# EAGLE design tracker (EAGLE 8.2.2)
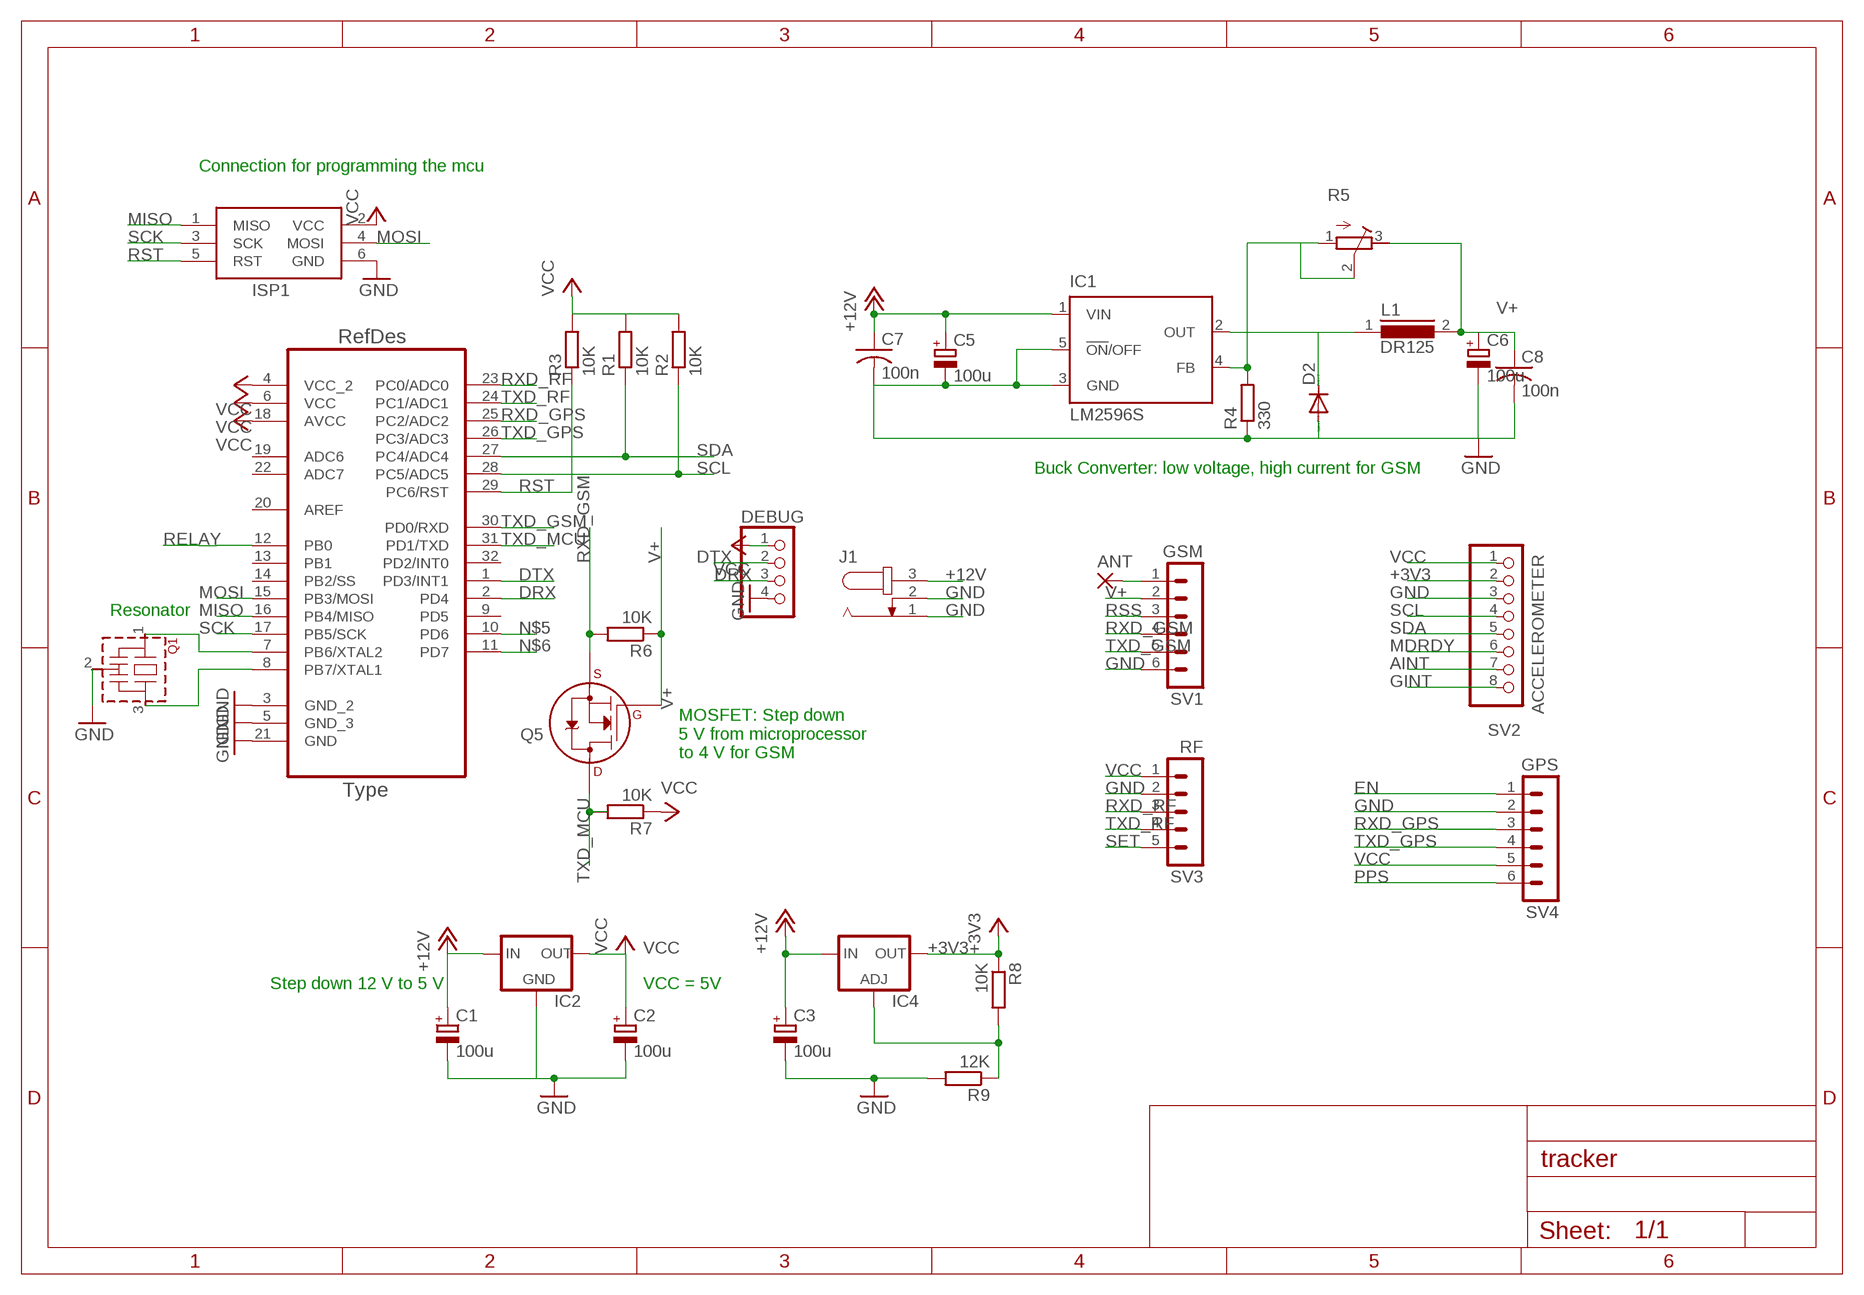
[diagram p0: schematic, sheet 1]

## Parts
ANT  WIREPAD2,15/1,0  [2,15/1,0]
C1  100u  CPOL-EUE2.5-5  [E2,5-5]
C2  100u  CPOL-EUE2.5-5  [E2,5-5]
C3  100u  CPOL-EUE2.5-5  [E2,5-5]
C5  100u  CPOL-EUE2.5-5  [E2,5-5]
C6  100u  CPOL-EUE2.5-5  [E2,5-5]
C7  100n  C-US025-024X044  [C025-024X044]
C8  100n  C-US025-024X044  [C025-024X044]
D2  DIODE-DO-214AC  [DO-214AC]
DEBUG  PINHD-1X4  [1X04]
IC1  LM2596S  [TO263-5]
IC2  78XXS  [78XXS]
IC4  LM317TS  [317TS]
ISP1  AVRISP-6  [AVRISP]
J1  JACK-PLUG0  [SPC4077]
L1  DR125  [DR125]
Q1  CSTLS_X  [CSTLS_X]
Q5  2N7000_TO92  [TO-92]
R1  10K  R-EU_R1210  [R1210]
R2  10K  R-EU_R1210  [R1210]
R3  10K  R-EU_R1210  [R1210]
R4  330  R-EU_R1210  [R1210]
R5  R-TRIMM64X  [RTRIM64X]
R6  10K  R-EU_R1210  [R1210]
R7  10K  R-EU_R1210  [R1210]
R8  10K  R-EU_0207/10  [0207/10]
R9  12K  R-EU_0207/10  [0207/10]
SV1  GSM  MA06-1  [MA06-1]
SV2  ACCELEROMETER  PINHD-1X8  [1X08]
SV3  RF  MA05-1  [MA05-1]
SV4  GPS  MA06-1  [MA06-1]
U1  ATMEGA328P-AU  [QFP80P900X900X120-32N]

## Nets
+3V3: IC4.2(OUT) R8.1 SV2.2
+12V: C1.+ C3.+ C5.+ C7.1 IC1.1(VIN) IC2.IN IC4.3(IN) J1.3
AINT: SV2.7
DRX: DEBUG.3 U1.2(PD4)
DTX: DEBUG.2 U1.1(PD3/INT1)
EN: SV4.1
GINT: SV2.8
GND: C1.- C2.- C3.- C5.- C6.- C7.2 C8.2 D2.A DEBUG.4 IC1.3(GND) IC1.5(!ON!/OFF) IC2.GND ISP1.6(GND) J1.1 J1.2 Q1.2(VSS) R4.1 R9.2 SV1.6 SV2.3 SV3.2 SV4.2 U1.3(GND_2) U1.5(GND_3) U1.21(GND)
MDRDY: SV2.6
MISO: ISP1.1(MISO) U1.16(PB4/MISO)
MOSI: ISP1.4(MOSI) U1.15(PB3/MOSI)
N$3: IC4.1(ADJ) R8.2 R9.1
N$4: ANT.1(P) SV1.1
N$5: U1.10(PD6)
N$6: U1.11(PD7)
N$8: Q1.1 U1.7(PB6/XTAL2)
N$9: Q1.3 U1.8(PB7/XTAL1)
N$11: D2.C IC1.2(OUT) L1.1
N$16: IC1.4(FB) R4.2 R5.1(A) R5.2(S)
PPS: SV4.6
RELAY: U1.12(PB0)
RSS: SV1.3
RST: ISP1.5(RST) R3.1 U1.29(PC6/RST)
RXD_GPS: SV4.3 U1.25(PC2/ADC2)
RXD_GSM: Q5.1(S) R6.2 SV1.4
RXD_RF: SV3.3 U1.23(PC0/ADC0)
SCK: ISP1.3(SCK) U1.17(PB5/SCK)
SCL: R2.1 SV2.4 U1.28(PC5/ADC5)
SDA: R1.1 SV2.5 U1.27(PC4/ADC4)
SET: SV3.5
TXD_GPS: SV4.4 U1.26(PC3/ADC3)
TXD_GSM: SV1.5 U1.30(PD0/RXD)
TXD_MCU: Q5.3(D) R7.2 U1.31(PD1/TXD)
TXD_RF: SV3.4 U1.24(PC1/ADC1)
V+: C6.+ C8.1 L1.2 Q5.2(G) R5.3(E) R6.1 SV1.2
VCC: C2.+ DEBUG.1 IC2.OUT ISP1.2(VCC) R1.2 R2.2 R3.2 R7.1 SV2.1 SV3.1 SV4.5 U1.4(VCC_2) U1.6(VCC) U1.18(AVCC)
Unconnected: U1.9(PD5) U1.13(PB1) U1.14(PB2/SS) U1.19(ADC6) U1.20(AREF) U1.22(ADC7) U1.32(PD2/INT0)

## Notes on the sheet
- Connection for programming the mcu
- Buck Converter: low voltage, high current for GSM
- Resonator
- MOSFET: Step down 
  5 V from microprocessor 
  to 4 V for GSM
- Step down 12 V to 5 V | VCC = 5V

## Library data of the parts
ANT = wirepad:WIREPAD: Wire PAD connect wire on PCB
C1-C3 C5 C6 = resistor:CPOL-EU: POLARIZED CAPACITOR, European symbol
C7 C8 = adafruit:C-US: CAPACITOR, American symbol
D2 = diode:DIODE-: DIODE
DEBUG = pinhead:PINHD-1X4: PIN HEADER
IC1 = national-semiconductor:LM2596: SIMPLE SWITCHER® Power Converter 150 kHz 3A Step-Down Voltage Regulator Source: http://www.national.com/ds/LM/LM2596.pdf; MF: NATIONAL SEMICONDUCTOR; MPN: LM2596S-ADJ/NOPB; OC_FARNELL: 9494367; OC_NEWARK: 41K3842
IC2 = v-reg:78XXS: VOLTAGE REGULATOR
IC4 = v-reg:LM317TS: VOLTAGE REGULATOR
ISP1 = adafruit:AVRISP: AVR ISP HEADER Standard 6 pin header for AVR programming
J1 = con-jack:JACK-PLUG: DC POWER JACK Power Jack, DC, Right Angle, Through Hole, Rated 5A at 16VDC, PC Terminals Distributor: Farnell (www.Farnell.de) Drawing: 84N1161.pdf / 84N1162.pdf Manufacturer: SPC Technology (www.spctechnology.com) Type: SPC4077 / SPC 4078; OC_FARNELL: unknown; OC_NEWARK: unknown
L1 = inductors:DR125: High Power Density, High Efficiency, Shielded Inductors Source: coiltronics_dr_series.pdf
Q1 = murata-resonators:CSTLS_X: Ceramic resonator 16.00 to 70.00 MHz
Q5 = transistors:2N700*: 2N7000, 2N7002, NDS7002A N-channel enhancement mode MOSFET
R1-R4 R6-R9 = resistor:R-EU_: RESISTOR, European symbol
R5 = resistor:R-TRIMM: Trimm resistor
SV1 SV4 = con-lstb:MA06-1: PIN HEADER; OC_FARNELL: unknown; OC_NEWARK: unknown
SV2 = pinhead:PINHD-1X8: PIN HEADER
SV3 = con-lstb:MA05-1: PIN HEADER; OC_FARNELL: unknown; OC_NEWARK: unknown
U1 = ATMEGA328P-AU:ATMEGA328P-AU; DESCRIPTION: 8-bit Microcontroller with In-System Programmable Flash; MPN: ATMEGA328P-AU; OC_FARNELL: 1715486; OC_NEWARK: 14R4631; PACKAGE: TQFP-32; SUPPLIER: Atmel

## Board
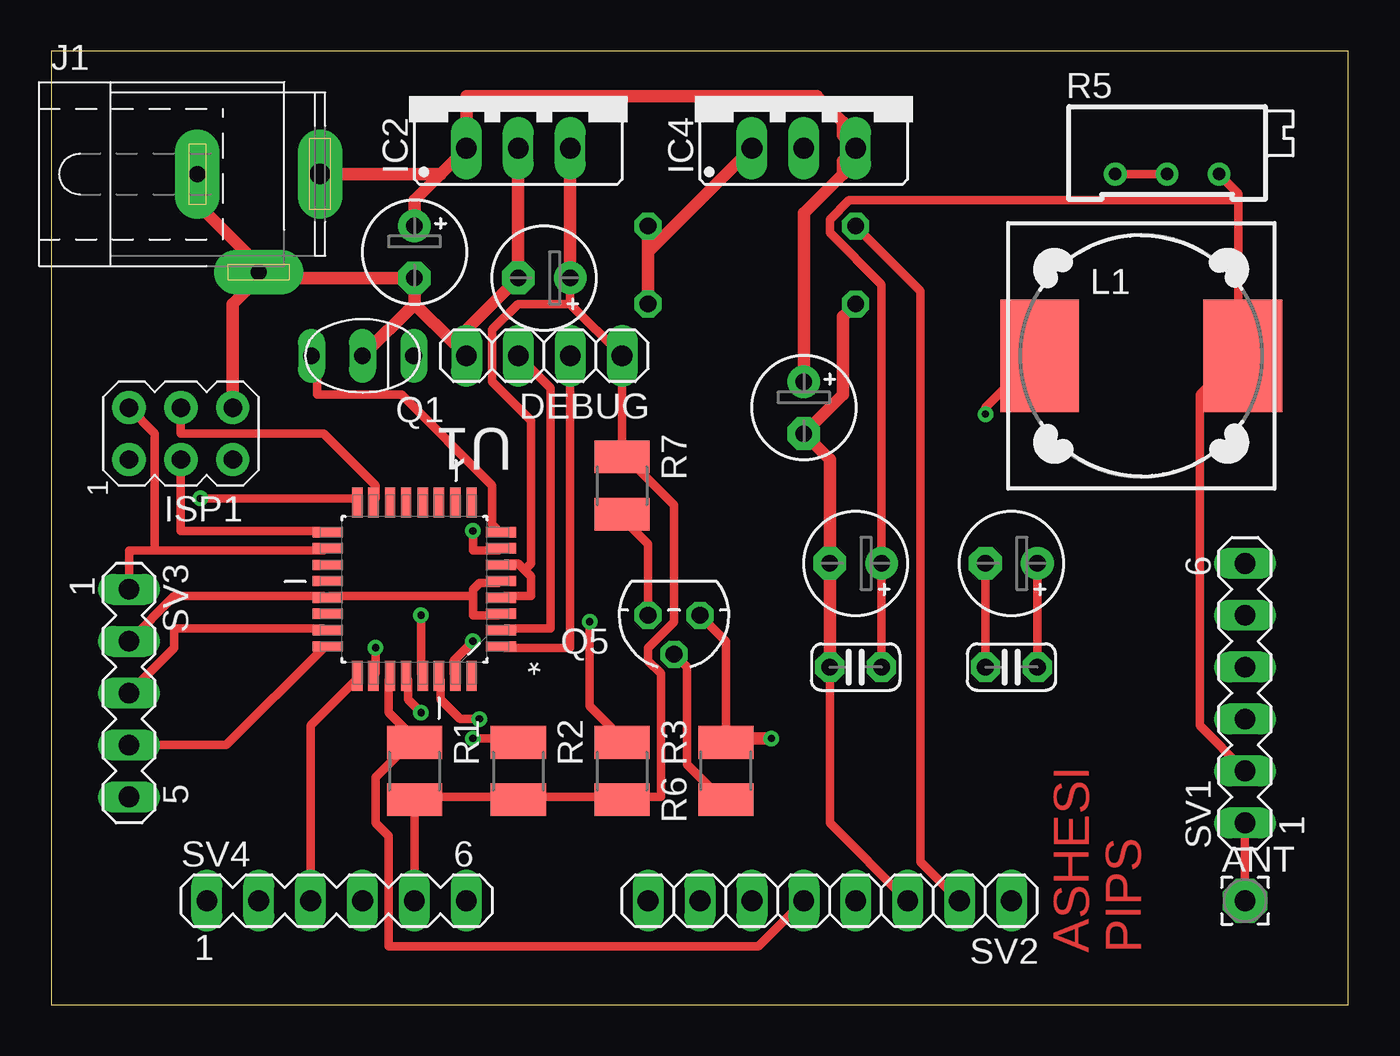
[diagram p1: board, top side]
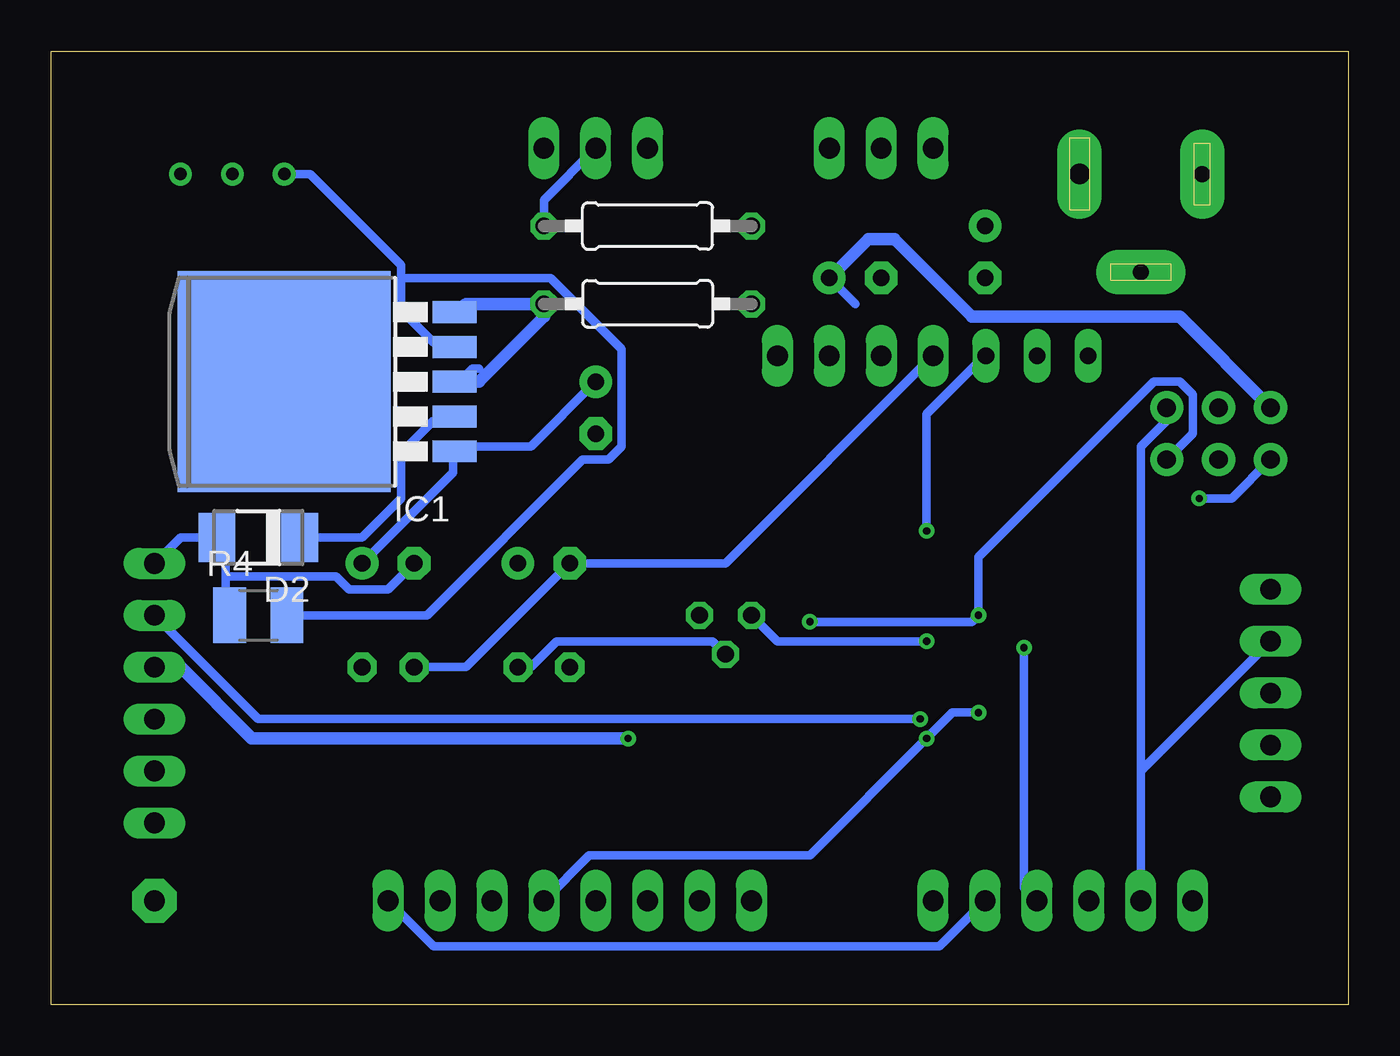
[diagram p2: board, bottom side, seen from below]

Size 63.48 x 46.66 mm. Coordinates in mm from the lower left corner, seen from the top.
Outline: 0,0 63.48,0 63.48,46.66 0,46.66 0,0
Copper layers (1*16): Top 0.035mm / dielectric 1.5mm / Bottom 0.035mm
Design rules "default *": minimum track width 24mil, minimum drill 0.35mm, track to track 10mil, track to pad 10mil, pad to pad 10mil, via to via 6mil, smd to smd 6mil, copper to edge 20mil, drill to drill 8mil, minimum pad ring 10mil, minimum via ring 8mil, stop-mask expansion 4mil, vias tented up to drill 0mil, thermal gap 10mil

### Footprints (pad centres in the part's own frame; a part is rotated, then mirrored left to right if it is on the bottom)
2,15/1,0 = drill 1.016 pad 2.159 octagon: 1 0,0
E2,5-5 = drill 0.813 pad 1.6: + -1.27,0 | drill 0.813 pad 1.6 octagon: - 1.27,0
C025-024X044 = drill 0.813 pad 1.422 octagon: 1 -1.27,0; 2 1.27,0
DO-214AC = smd 1.8 x 2.4: A 2.025,0; C -2.025,0
1X04 = drill 1.016 long: 1 -3.81,0; 2 -1.27,0; 3 1.27,0; 4 3.81,0
TO263-5 = smd 1.067 x 2.159: 1 -3.404,-5.791; 2 -1.702,-5.791; 3 0,-5.791; 4 1.702,-5.791; 5 3.404,-5.791 | smd 10.8 x 10.41: 6 0,2.54
78XXS = drill 1.016 long: GND 0,-2.54; IN -2.54,-2.54; OUT 2.54,-2.54
317TS = drill 1.016 long: 1 -2.54,-2.54; 2 0,-2.54; 3 2.54,-2.54
AVRISP = drill 0.9 pad 1.626: 1 -1.27,2.54; 2 1.27,2.54; 3 -1.27,0; 4 1.27,0; 5 -1.27,-2.54; 6 1.27,-2.54
SPC4077 = drill 0.8 pad 2.184 long: 1 -3,0; 2 0,-4.8 | drill 1 pad 2.184 long: 3 3,0
DR125 = smd 3.85 x 5.5: 1 -4.975,0; 2 4.975,0
CSTLS_X = drill 0.813 long: 1 -2.5,0; 2 0,0; 3 2.5,0
TO-92 = drill 0.813 octagon: 1 -1.27,0; 2 0,1.905; 3 1.27,0
R1210 = smd 1.6 x 2.7: 1 -1.4,0; 2 1.4,0
RTRIM64X = drill 0.61: 1 1.27,-2.54; 2 1.27,0; 3 1.27,2.54
0207/10 = drill 0.813 octagon: 1 -5.08,0; 2 5.08,0
MA06-1 = drill 1.016 long: 1 -6.35,0; 2 -3.81,0; 3 -1.27,0; 4 1.27,0; 5 3.81,0; 6 6.35,0
1X08 = drill 1.016 long: 1 -8.89,0; 2 -6.35,0; 3 -3.81,0; 4 -1.27,0; 5 1.27,0; 6 3.81,0; 7 6.35,0; 8 8.89,0
MA05-1 = drill 1.016 long: 1 -5.08,0; 2 -2.54,0; 3 0,0; 4 2.54,0; 5 5.08,0
QFP80P900X900X120-32N = smd 1.473 x 0.508: 1 -4.242,2.794; 2 -4.242,2.007; 3 -4.242,1.194; 4 -4.242,0.406; 5 -4.242,-0.406; 6 -4.242,-1.194; 7 -4.242,-2.007; 8 -4.242,-2.794; 17 4.242,-2.794; 18 4.242,-2.007; 19 4.242,-1.194; 20 4.242,-0.406; 21 4.242,0.406; 22 4.242,1.194; 23 4.242,2.007; 24 4.242,2.794 | smd 0.508 x 1.473: 9 -2.794,-4.242; 10 -2.007,-4.242; 11 -1.194,-4.242; 12 -0.406,-4.242; 13 0.406,-4.242; 14 1.194,-4.242; 15 2.007,-4.242; 16 2.794,-4.242; 25 2.794,4.242; 26 2.007,4.242; 27 1.194,4.242; 28 0.406,4.242; 29 -0.406,4.242; 30 -1.194,4.242; 31 -2.007,4.242; 32 -2.794,4.242

### Placement (x,y rotation side)
ANT  58.42,5.08 0 top
C1  36.83,29.21 270 top
C2  24.13,35.56 180 top
C3  17.78,36.83 270 top
C5  46.99,21.59 180 top
C6  39.37,21.59 180 top
C7  46.99,16.51 180 top
C8  39.37,16.51 180 top
D2  53.34,22.86 180 bottom
DEBUG  24.13,31.75 180 top
IC1  49.53,30.48 90 bottom
IC2  22.86,44.45 0 top
IC4  36.83,44.45 0 top
ISP1  6.35,27.94 90 top
J1  10.16,40.64 0 top
L1  53.34,31.75 0 top
Q1  15.24,31.75 180 top
Q5  30.48,19.05 180 top
R1  17.78,11.43 270 top
R2  22.86,11.43 270 top
R3  27.94,11.43 270 top
R4  53.34,19.05 0 bottom
R5  54.61,41.91 270 top
R6  33.02,11.43 90 top
R7  27.94,25.4 270 top
R8  34.29,38.1 0 bottom
R9  34.29,34.29 180 bottom
SV1  58.42,15.24 90 top
SV2  38.1,5.08 180 top
SV3  3.81,15.24 270 top
SV4  13.97,5.08 0 top
U1  17.78,20.32 180 top

### Tracks (layer width: path | path; a pad name or v marks a point on that pad's centre or on a via)
+3V3
  Top 0.406: SV2.2 42.55,6.99 42.55,34.93 R8.1
  Bottom 0.406: R8.1 39.37,39.37 IC4.2
+12V
  Top 0.406: C5.+ C7.1
  Top 0.61: C1.+ 36.83,38.73 38.73,40.64 38.73,41.28 IC4.3 38.73,42.55 38.73,43.18 37.47,44.45 20.32,44.45 IC2.IN 19.05,40.64 | 19.05,40.64 17.78,39.37 C3.+ | 19.05,40.64 J1.3
  Bottom 0.406: C5.+ 43.81,26.04 43.81,26.99 IC1.1 43.5,27.3 40,27.3 C1.+
DRX
  Top 0.406: DEBUG.3 24.45,30.16 24.45,18.41 22.22,18.41 U1.2
DTX
  Top 0.406: DEBUG.2 25.4,17.46 22.22,17.46 U1.1
GND
  Top 0.406: C5.- C7.2 | SV2.3 38.1,8.89 C8.2 | 20.64,20 20.64,20.32 20.96,20.64 21.91,20.64 U1.5 | 20.64,20 20.64,19.05 21.91,19.05 U1.3 | SV3.2 6.03,20 13.33,20 U1.21 13.65,20 20.64,20
  Top 0.61: J1.1 7.62,40.64 7.62,38.73 10.16,36.2 J1.2 10.16,35.56 | 10.16,35.56 8.89,34.29 ISP1.6 | IC2.GND C2.- 19.68,32.39 | 17.78,34.29 Q1.2 | 17.78,34.29 C3.- 10.16,35.56 | R9.2 38.73,33.66 38.73,29.85 C1.- 38.1,26.67 C6.- C8.2 | 19.68,32.39 17.78,34.29 | 19.68,32.39 DEBUG.4
  Bottom 0.406: SV1.6 57.15,22.86 D2.A 55.24,22.86 54.93,22.54 54.93,20.95 | 54.93,20.95 54.93,19.05 R4.1 | 42.55,31.11 42.86,31.11 43.5,30.48 IC1.3 | 43.5,33.66 IC1.5 | C7.2 43.18,16.51 C6.- 30.48,21.59 DEBUG.4 | 54.93,20.95 49.53,20.95 48.89,20.32 46.99,20.32 C5.- | 10.16,11.43 SV4.2 | SV3.2 10.16,11.43 | ISP1.6 8.89,28.57 10.16,27.3 10.16,11.43
  Bottom 0.61: IC1.3 42.55,30.48 39.37,33.66 R9.2 43.18,34.29 IC1.5
MISO  (via drill 0.35)
  Top 0.406: v7.3,24.76 14.92,24.76 U1.16
  Bottom 0.406: v7.3,24.76 5.71,24.76 ISP1.1
MOSI
  Top 0.406: ISP1.4 6.35,27.94 13.33,27.94 15.87,25.4 15.87,24.76 U1.15
N$3
  Top 0.61: R8.2 29.21,36.83 | 29.21,36.83 R9.1 | 29.21,36.83 IC4.1
N$4
  Top 0.406: ANT.1 SV1.1
N$8  (via drill 0.35)
  Top 0.406: v20.64,23.18 20.64,22.22 21.91,22.22 U1.7
  Bottom 0.406: v20.64,23.18 20.64,28.89 17.78,31.75 Q1.1
N$9
  Top 0.406: U1.8 21.91,23.18 21.59,23.49 21.59,25.4 17.14,29.85 13.02,29.85 13.02,31.75 Q1.3
N$11  (via drill 0.35)
  Top 0.406: v45.72,28.89 45.72,29.21 48.26,31.75 L1.1
  Bottom 0.406: 45.08,28.26 46.36,26.99 46.36,24.76 48.26,22.86 D2.C | 45.08,28.26 44.77,28.57 43.81,28.57 IC1.2 | 45.08,28.26 v45.72,28.89
N$16
  Top 0.406: R5.1 R5.2
  Bottom 0.406: 46.36,35.56 46.36,36.2 50.8,40.64 R5.1 | 46.36,35.56 46.36,33.97 44.77,32.39 43.81,32.39 IC1.4 | R4.2 45.08,19.05 37.47,26.67 36.19,26.67 35.56,27.3 35.56,32.07 39.05,35.56 46.36,35.56
RST  (via drill 0.35)
  Top 0.406: v18.1,19.05 18.1,16.19 U1.29 | v26.35,18.73 26.35,14.61 27.94,13.02 R3.1
  Bottom 0.406: ISP1.5 7.62,27.94 7.62,29.85 8.25,30.48 9.52,30.48 18.1,21.91 v18.1,19.05 18.41,18.73 v26.35,18.73
RXD_GPS
  Top 0.406: SV4.3 12.7,13.65 14.92,15.88 U1.25
RXD_GSM  (via drill 0.35)
  Top 0.406: Q5.1 33.02,17.78 33.02,13.02
  Top 0.61: v35.24,13.02 33.02,13.02 R6.2
  Bottom 0.61: SV1.4 57.15,16.51 53.66,13.02 v35.24,13.02
RXD_RF
  Top 0.406: SV3.3 6.03,17.46 6.03,18.41 13.33,18.41 U1.23
SCK
  Top 0.406: ISP1.3 6.35,23.18 13.33,23.18 U1.17
SCL  (via drill 0.35)
  Top 0.406: v18.1,14.29 17.46,14.92 17.46,15.88 U1.28 | v20.64,13.02 22.86,13.02 R2.1
  Bottom 0.406: v18.1,14.29 19.37,14.29 v20.64,13.02 26.35,7.3 37.15,7.3 SV2.4
SDA
  Top 0.406: 17.78,13.02 16.51,14.29 16.51,15.88 U1.27 | SV2.5 34.61,2.86 16.51,2.86 16.51,8.25 15.87,8.89 15.87,11.11 17.78,13.02 | 17.78,13.02 R1.1
TXD_GPS  (via drill 0.35)
  Top 0.406: v15.87,17.46 15.87,16.19 U1.26
  Bottom 0.406: v15.87,17.46 15.87,5.72 SV4.4
TXD_GSM  (via drill 0.35)
  Top 0.406: v20.96,13.97 20,13.97 19.05,14.92 19.05,15.88 U1.30
  Bottom 0.406: v20.96,13.97 53.34,13.97 SV1.5
TXD_MCU  (via drill 0.35)
  Top 0.406: v20.64,17.78 19.68,16.83 19.68,16.19 U1.31 | Q5.3 29.21,22.54 27.94,23.81 R7.2
  Bottom 0.406: v20.64,17.78 27.94,17.78 Q5.3
TXD_RF
  Top 0.406: SV3.4 8.57,12.7 13.33,17.46 U1.24
V+
  Top 0.406: C8.1 C6.+ 40.64,35.24 38.1,37.78 38.1,38.42 39.05,39.37 58.1,39.37 | Q5.2 31.11,16.51 31.11,11.75 33.02,9.84 R6.1 | R5.3 58.1,39.69 58.1,39.37 | 58.1,31.75 58.1,39.37 | SV1.2 56.2,13.65 56.2,29.85 58.1,31.75 | 58.1,31.75 L1.2
  Bottom 0.406: C8.1 40,16.51 38.73,17.78 31.11,17.78 Q5.2
VCC
  Top 0.406: SV4.5 R1.2 17.78,10.16 22.86,10.16 | 22.86,10.16 27.94,10.16 | 22.86,10.16 R2.2 | 5.08,22.22 3.81,22.22 SV3.1 | 5.08,22.22 13.33,22.22 U1.18 | ISP1.2 5.08,27.94 5.08,22.22 | 27.94,26.99 DEBUG.1 25.4,34.29 | 23.18,21.27 22.86,21.59 22.22,21.59 U1.6 | 23.18,21.27 23.5,20.95 23.5,20 22.22,20 U1.4 | 23.18,21.27 23.5,21.59 23.5,28.57 21.59,30.48 21.59,33.02 22.86,34.29 25.4,34.29 | C2.+ 25.4,34.29 | 27.94,10.16 29.84,10.16 29.84,16.19 29.21,16.83 29.21,17.46 30.48,18.73 30.48,24.45 27.94,26.99 | 27.94,10.16 R3.2 | 27.94,26.99 R7.1
  Top 0.61: C2.+ IC2.OUT
  Bottom 0.406: SV2.1 44.77,2.86 20,2.86 SV4.5 | C2.+ 24.13,34.29
  Bottom 0.61: C2.+ 23.5,37.47 22.22,37.47 18.41,33.66 8.25,33.66 ISP1.2

### Text on the board
Top: ASHESI | PIPS